# EAGLE schematic LED_BAR (EAGLE 7.2.0)
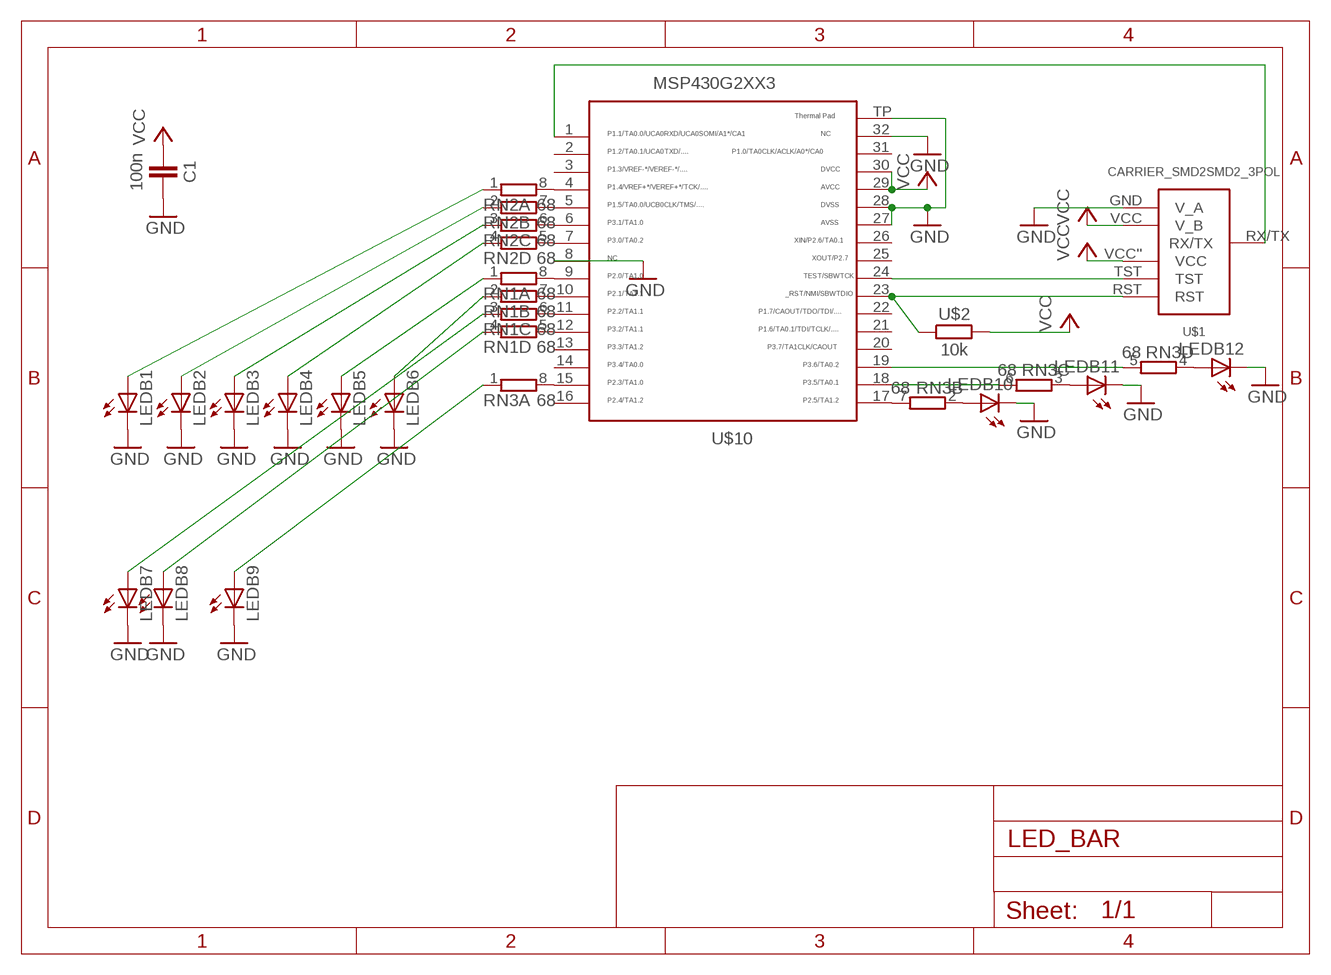
[diagram p0: schematic, sheet 1]

## Parts
C1  100n  CAPACITOR  [603]
LEDB1  LEDCHIPLED_0603  [CHIPLED_0603]
LEDB2  LEDCHIPLED_0603  [CHIPLED_0603]
LEDB3  LEDCHIPLED_0603  [CHIPLED_0603]
LEDB4  LEDCHIPLED_0603  [CHIPLED_0603]
LEDB5  LEDCHIPLED_0603  [CHIPLED_0603]
LEDB6  LEDCHIPLED_0603  [CHIPLED_0603]
LEDB7  LEDCHIPLED_0603  [CHIPLED_0603]
LEDB8  LEDCHIPLED_0603  [CHIPLED_0603]
LEDB9  LEDCHIPLED_0603  [CHIPLED_0603]
LEDB10  LEDCHIPLED_0603  [CHIPLED_0603]
LEDB11  LEDCHIPLED_0603  [CHIPLED_0603]
LEDB12  LEDCHIPLED_0603  [CHIPLED_0603]
RN1  68  4R-N0603-ARC  [0603-ARC]
RN2  68  4R-N0603-ARC  [0603-ARC]
RN3  68  4R-N0603-ARC  [0603-ARC]
U$1  CARRIER_SMD2SMD2_3POL  [CARRIER_SMD2_3POL]
U$2  10k  RESISTOR0603  [603]
U$10  MSP430G2553  [QFN32]

## Nets
GND: C1.2 LEDB1.C LEDB2.C LEDB3.C LEDB4.C LEDB5.C LEDB6.C LEDB7.C LEDB8.C LEDB9.C LEDB10.C LEDB11.C LEDB12.C U$1.GND(V_A) U$10.8 U$10.27 U$10.28 U$10.32 U$10.TP
N$3: U$1.TST U$10.24
N$4: U$1.RST U$2.1 U$10.23
N$5: LEDB1.A RN2.1
N$6: LEDB2.A RN2.2
N$7: LEDB3.A RN2.3
N$11: RN2.8 U$10.4
N$12: U$1.RX/TX U$10.1
N$13: LEDB4.A RN2.4
N$14: LEDB5.A RN1.1
N$16: LEDB6.A RN1.2
N$17: RN2.7 U$10.5
N$18: LEDB7.A RN1.3
N$19: LEDB8.A RN1.4
N$20: LEDB9.A RN3.1
N$21: RN2.6 U$10.6
N$22: RN2.5 U$10.7
N$23: RN1.8 U$10.9
N$24: RN3.5 U$10.19
N$25: RN3.6 U$10.18
N$26: RN1.7 U$10.10
N$27: RN1.6 U$10.11
N$28: RN1.5 U$10.12
N$29: RN3.8 U$10.15
N$32: RN3.7 U$10.17
N$34: LEDB10.A RN3.2
N$35: LEDB11.A RN3.3
N$36: LEDB12.A RN3.4
VCC: C1.1 U$1.VCC''(VCC) U$1.VCC(V_B) U$2.2 U$10.29 U$10.30
Unconnected: U$10.2 U$10.3 U$10.13 U$10.14 U$10.16 U$10.20 U$10.21 U$10.22 U$10.25 U$10.26 U$10.31

## Library data of the parts
C1 = thar:CAPACITOR
LEDB1-LEDB12 = led:LED: LED OSRAM: - CHIPLED LG R971, LG N971, LY N971, LG Q971, LY Q971, LO R971, LY R971 LH N974, LH R974 LS Q976, LO Q976, LY Q976 LO Q996 - Hyper CHIPLED LW Q18S LB Q993, LB Q99A, LB R99A - SideLED LS A670, LO A670, LY A670, LG A670, LP A670 LB A673, LV A673, LT A673, LW A673 LH A674 LY A675 LS A676, LA A676, LO A676, LY A676, LW A676 LS A679, LY A679, LG A679 - Hyper Micro SIDELED® LS Y876, LA Y876, LO Y876, LY Y876 LT Y87S - SmartLED LW L88C, LW L88S LB L89C, LB L89S, LG L890 LS L89K, LO L89K, LY L89K LS L896, LA L896, LO L896, LY L896 - TOPLED LS T670, LO T670, LY T670, LG T670, LP T670 LSG T670, LSP T670, LSY T670, LOP T670, LYG T670 LG T671, LOG T671, LSG T671 LB T673, LV T673, LT T673, LW T673 LH T674 LS T676, LA T676, LO T676, LY T676, LB T676, LH T676, LSB T676, LW T676 LB T67C, LV T67C, LT T67C, LS T67K, LO T67K, LY T67K, LW E67C LS E67B, LA E67B, LO E67B, LY E67B, LB E67C, LV E67C, LT E67C LW T67C LS T679, LY T679, LG T679 LS T770, LO T770, LY T770, LG T770, LP T770 LB T773, LV T773, LT T773, LW T773 LH T774 LS E675, LA E675, LY E675, LS T675 LS T776, LA T776, LO T776, LY T776, LB T776 LHGB T686 LT T68C, LB T68C - Hyper Mini TOPLED® LB M676 - Mini TOPLED Santana® LG M470 LS M47K, LO M47K, LY M47K Source: http://www.osram.convergy.de LUXEON: - LUMILED® LXK2-PW12-R00, LXK2-PW12-S00, LXK2-PW14-U00, LXK2-PW14-V00 LXK2-PM12-R00, LXK2-PM12-S00, LXK2-PM14-U00 LXK2-PE12-Q00, LXK2-PE12-R00, LXK2-PE12-S00, LXK2-PE14-T00, LXK2-PE14-U00 LXK2-PB12-K00, LXK2-PB12-L00, LXK2-PB12-M00, LXK2-PB14-N00, LXK2-PB14-P00, LXK2-PB14-Q00 LXK2-PR12-L00, LXK2-PR12-M00, LXK2-PR14-Q00, LXK2-PR14-R00 LXK2-PD12-Q00, LXK2-PD12-R00, LXK2-PD12-S00 LXK2-PH12-R00, LXK2-PH12-S00 LXK2-PL12-P00, LXK2-PL12-Q00, LXK2-PL12-R00 Source: www.luxeon.com KINGBRIGHT: KA-3528ASYC Source: www.kingbright.com
RN1-RN3 = resistor-dil:4R-N: Array Chip Resistor Source: RS Component / Phycomp; OC_FARNELL: unknown; OC_NEWARK: unknown
U$1 = thar:CARRIER_SMD2
U$2 = thar:RESISTOR
U$10 = thar:MSP430G2553: TEXAS INSTRUMENTS MSP430G2553IRHB32R MCU, 16BIT, MSP430, 16MHZ, QFN-32 Farnell Best.Nr.: 2325726 Herst.Bez.: MSP430G2553IRHB32R